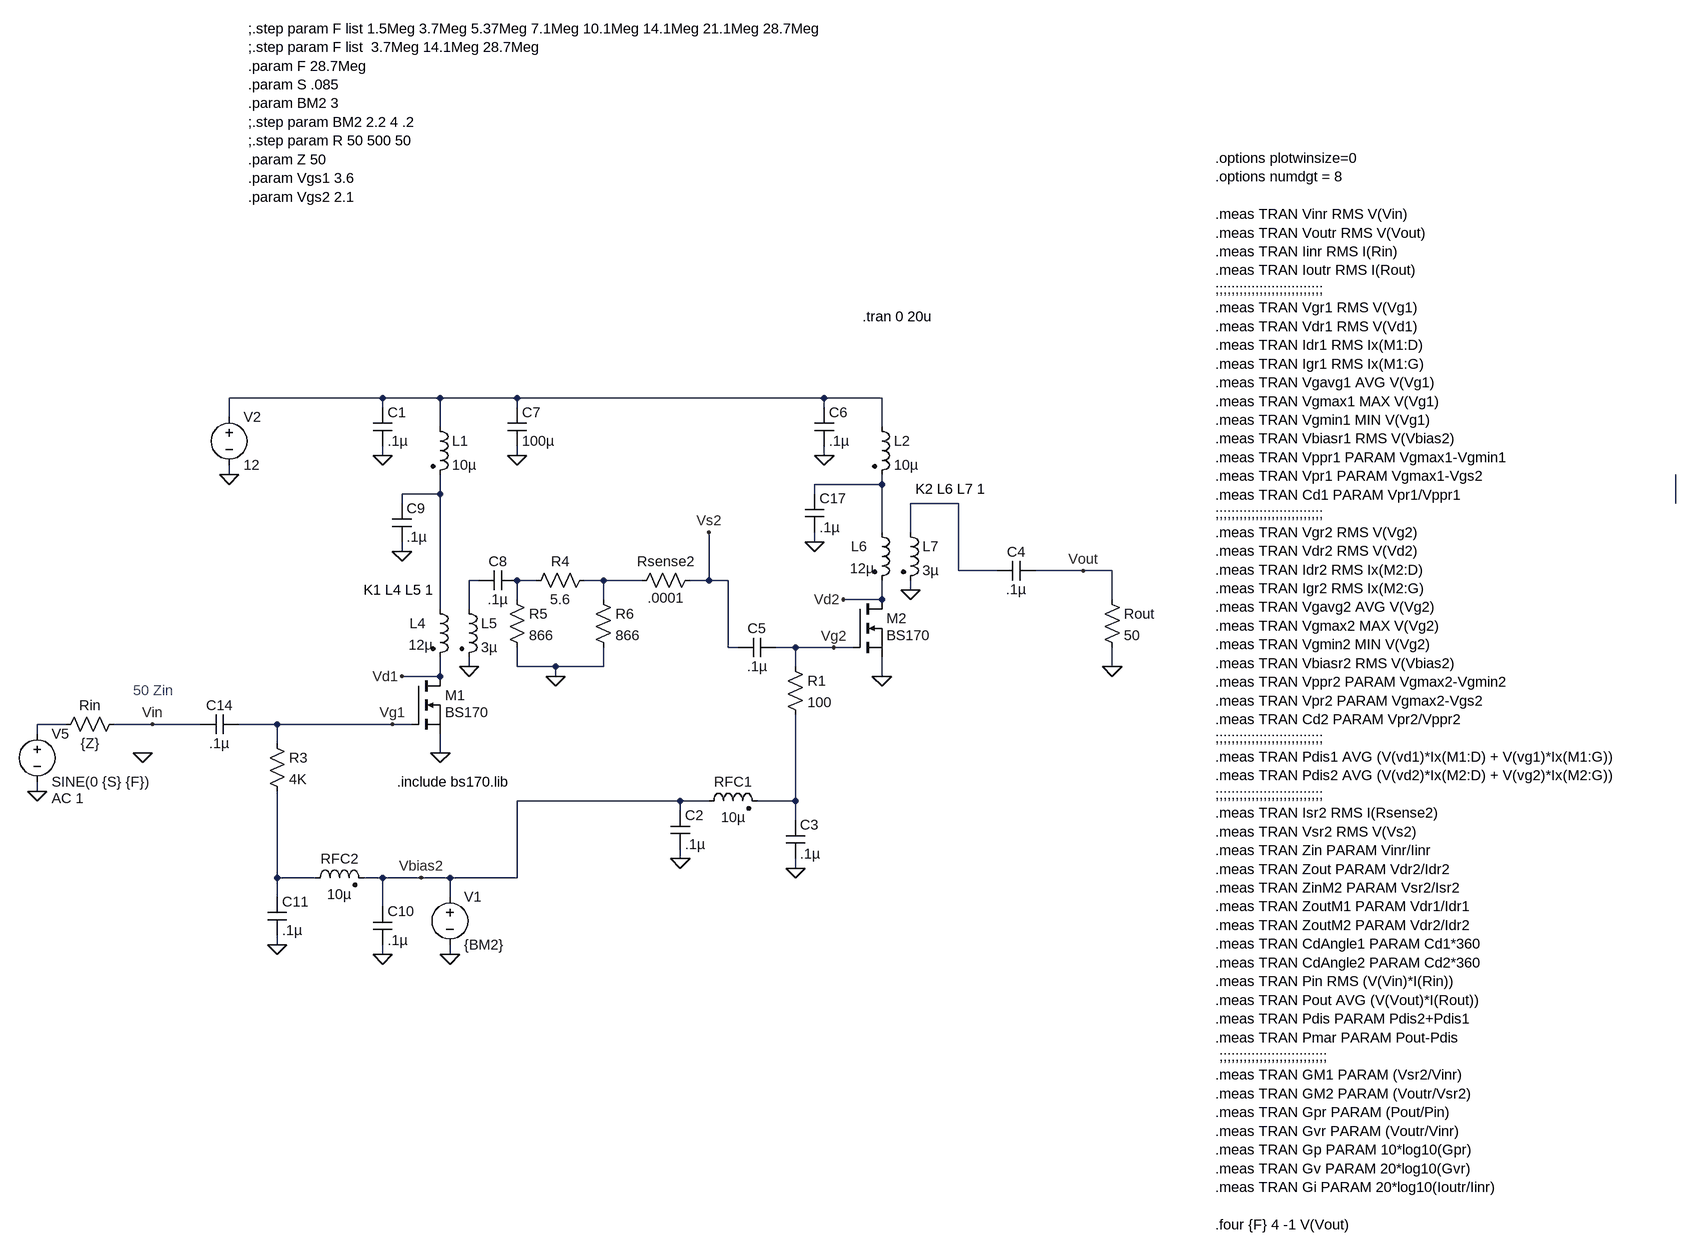
[diagram p0: schematic BS170 x2 Pre Amp Testing.asc]
BS170 x2 Pre Amp Testing.asc, the LTspice schematic file:
Version 4
SHEET 1 4348 1616
WIRE 512 -176 256 -176
WIRE 608 -176 512 -176
WIRE 736 -176 608 -176
WIRE 1248 -176 736 -176
WIRE 1344 -176 1248 -176
WIRE 512 -160 512 -176
WIRE 736 -160 736 -176
WIRE 1248 -160 1248 -176
WIRE 256 -144 256 -176
WIRE 608 -128 608 -176
WIRE 1344 -128 1344 -176
WIRE 512 -80 512 -96
WIRE 736 -80 736 -96
WIRE 1248 -80 1248 -96
WIRE 256 -48 256 -64
WIRE 1344 -32 1344 -48
WIRE 1344 -32 1232 -32
WIRE 608 -16 608 -48
WIRE 608 -16 544 -16
WIRE 1232 -16 1232 -32
WIRE 544 0 544 -16
WIRE 1472 0 1392 0
WIRE 3968 0 3968 -48
WIRE 1344 48 1344 -32
WIRE 1392 48 1392 0
WIRE 1232 64 1232 48
WIRE 544 80 544 64
WIRE 1472 112 1472 0
WIRE 1536 112 1472 112
WIRE 1680 112 1600 112
WIRE 1728 112 1680 112
WIRE 672 128 656 128
WIRE 768 128 736 128
WIRE 880 128 848 128
WIRE 944 128 880 128
WIRE 1056 128 1056 48
WIRE 1056 128 1024 128
WIRE 1088 128 1056 128
WIRE 1392 144 1392 128
WIRE 736 160 736 128
WIRE 880 160 880 128
WIRE 1344 160 1344 128
WIRE 1344 160 1280 160
WIRE 1728 160 1728 112
WIRE 608 176 608 -16
WIRE 656 176 656 128
WIRE 1088 240 1088 128
WIRE 1104 240 1088 240
WIRE 1200 240 1168 240
WIRE 1264 240 1200 240
WIRE 1296 240 1264 240
WIRE 656 272 656 256
WIRE 736 272 736 240
WIRE 800 272 736 272
WIRE 880 272 880 240
WIRE 880 272 800 272
WIRE 1200 272 1200 240
WIRE 1728 272 1728 240
WIRE 608 288 608 256
WIRE 608 288 544 288
WIRE 800 288 800 272
WIRE 1344 288 1344 256
WIRE -16 368 -64 368
WIRE 128 368 64 368
WIRE 208 368 128 368
WIRE 336 368 272 368
WIRE 528 368 336 368
WIRE 560 368 528 368
WIRE -64 384 -64 368
WIRE 336 400 336 368
WIRE 608 416 608 384
WIRE -64 480 -64 464
WIRE 1008 496 736 496
WIRE 1056 496 1008 496
WIRE 1200 496 1200 352
WIRE 1200 496 1136 496
WIRE 1008 512 1008 496
WIRE 1200 528 1200 496
WIRE 1008 592 1008 576
WIRE 1200 608 1200 592
WIRE 336 624 336 480
WIRE 400 624 336 624
WIRE 512 624 480 624
WIRE 576 624 512 624
WIRE 624 624 576 624
WIRE 736 624 736 496
WIRE 736 624 624 624
WIRE 336 656 336 624
WIRE 624 656 624 624
WIRE 512 672 512 624
WIRE 336 736 336 720
WIRE 512 752 512 736
WIRE 624 752 624 736
FLAG 256 -48 0
FLAG 1728 272 0
FLAG 1680 112 Vout
FLAG -64 480 0
FLAG 128 368 Vin
FLAG 608 416 0
FLAG 528 368 Vg1
FLAG 544 288 Vd1
FLAG 512 752 0
FLAG 336 736 0
FLAG 624 752 0
FLAG 576 624 Vbias2
FLAG 112 416 0
FLAG 512 -80 0
FLAG 1344 288 0
FLAG 1264 240 Vg2
FLAG 1280 160 Vd2
FLAG 1008 592 0
FLAG 1200 608 0
FLAG 1248 -80 0
FLAG 736 -80 0
FLAG 1056 48 Vs2
FLAG 544 80 0
FLAG 656 272 0
FLAG 1392 144 0
FLAG 1232 64 0
FLAG 800 288 0
SYMBOL voltage 256 -160 R0
WINDOW 123 0 0 Left 2
WINDOW 39 0 0 Left 2
SYMATTR InstName V2
SYMATTR Value 12
SYMBOL res 1712 144 R0
SYMATTR InstName Rout
SYMATTR Value 50
SYMBOL voltage -64 368 R0
WINDOW 123 24 124 Left 2
WINDOW 39 24 152 Left 2
SYMATTR Value2 AC 1
SYMATTR InstName V5
SYMATTR Value SINE(0 {S} {F})
SYMBOL nmos 560 288 R0
WINDOW 3 56 60 Left 2
SYMATTR Value BS170
SYMATTR InstName M1
SYMATTR Prefix X
SYMBOL res 320 384 R0
SYMATTR InstName R3
SYMATTR Value 4K
SYMBOL cap 1536 128 R270
WINDOW 0 32 32 VTop 2
WINDOW 3 0 32 VBottom 2
SYMATTR InstName C4
SYMATTR Value .1µ
SYMBOL ind2 384 640 R270
WINDOW 0 32 56 VTop 2
WINDOW 3 4 56 VBottom 2
SYMATTR InstName RFC2
SYMATTR Value 10µ
SYMATTR Type ind
SYMBOL cap 496 672 R0
SYMATTR InstName C10
SYMATTR Value .1µ
SYMBOL cap 320 656 R0
SYMATTR InstName C11
SYMATTR Value .1µ
SYMBOL voltage 624 640 R0
WINDOW 123 0 0 Left 2
WINDOW 39 0 0 Left 2
SYMATTR InstName V1
SYMATTR Value {BM2}
SYMBOL ind2 592 -144 R0
SYMATTR InstName L1
SYMATTR Value 10µ
SYMATTR Type ind
SYMBOL cap 208 384 R270
WINDOW 0 32 32 VTop 2
WINDOW 3 0 32 VBottom 2
SYMATTR InstName C14
SYMATTR Value .1µ
SYMBOL cap 496 -160 R0
SYMATTR InstName C1
SYMATTR Value .1µ
SYMBOL nmos 1296 160 R0
WINDOW 3 56 60 Left 2
SYMATTR Value BS170
SYMATTR InstName M2
SYMATTR Prefix X
SYMBOL res 1184 256 R0
SYMATTR InstName R1
SYMATTR Value 100
SYMBOL ind2 1040 512 R270
WINDOW 0 32 56 VTop 2
WINDOW 3 4 56 VBottom 2
SYMATTR InstName RFC1
SYMATTR Value 10µ
SYMATTR Type ind
SYMBOL cap 992 512 R0
SYMATTR InstName C2
SYMATTR Value .1µ
SYMBOL cap 1184 528 R0
SYMATTR InstName C3
SYMATTR Value .1µ
SYMBOL ind2 1328 -144 R0
SYMATTR InstName L2
SYMATTR Value 10µ
SYMATTR Type ind
SYMBOL cap 1104 256 R270
WINDOW 0 32 32 VTop 2
WINDOW 3 0 32 VBottom 2
SYMATTR InstName C5
SYMATTR Value .1µ
SYMBOL cap 1232 -160 R0
SYMATTR InstName C6
SYMATTR Value .1µ
SYMBOL cap 720 -160 R0
SYMATTR InstName C7
SYMATTR Value 100µ
SYMBOL res 1040 112 R90
WINDOW 0 0 56 VBottom 2
WINDOW 3 30 56 VTop 2
SYMATTR InstName Rsense2
SYMATTR Value .0001
SYMBOL res 80 352 R90
WINDOW 0 0 56 VBottom 2
WINDOW 3 32 56 VTop 2
SYMATTR InstName Rin
SYMATTR Value {Z}
SYMBOL ind2 592 160 R0
WINDOW 0 -35 40 Left 2
WINDOW 3 -37 76 Left 2
SYMATTR InstName L4
SYMATTR Value 12µ
SYMATTR Type ind
SYMBOL ind2 640 160 R0
SYMATTR InstName L5
SYMATTR Value 3µ
SYMATTR Type ind
SYMBOL res 864 112 R90
WINDOW 0 0 56 VBottom 2
WINDOW 3 32 56 VTop 2
SYMATTR InstName R4
SYMATTR Value 5.6
SYMBOL res 720 144 R0
SYMATTR InstName R5
SYMATTR Value 866
SYMBOL res 864 144 R0
SYMATTR InstName R6
SYMATTR Value 866
SYMBOL cap 736 112 R90
WINDOW 0 0 32 VBottom 2
WINDOW 3 32 32 VTop 2
SYMATTR InstName C8
SYMATTR Value .1µ
SYMBOL cap 528 0 R0
SYMATTR InstName C9
SYMATTR Value .1µ
SYMBOL ind2 1328 32 R0
WINDOW 0 -35 40 Left 2
WINDOW 3 -37 76 Left 2
SYMATTR InstName L6
SYMATTR Value 12µ
SYMATTR Type ind
SYMBOL ind2 1376 32 R0
SYMATTR InstName L7
SYMATTR Value 3µ
SYMATTR Type ind
SYMBOL cap 1216 -16 R0
SYMATTR InstName C17
SYMATTR Value .1µ
TEXT 2912 -576 Left 2 !.options plotwinsize=0\n.options numdgt = 8\n \n.meas TRAN Vinr RMS V(Vin)\n.meas TRAN Voutr RMS V(Vout)\n.meas TRAN Iinr RMS I(Rin)\n.meas TRAN Ioutr RMS I(Rout)\n;;;;;;;;;;;;;;;;;;;;;;;;;;;\n.meas TRAN Vgr1 RMS V(Vg1)\n.meas TRAN Vdr1 RMS V(Vd1)\n.meas TRAN Idr1 RMS Ix(M1:D)\n.meas TRAN Igr1 RMS Ix(M1:G)\n.meas TRAN Vgavg1 AVG V(Vg1)\n.meas TRAN Vgmax1 MAX V(Vg1)\n.meas TRAN Vgmin1 MIN V(Vg1)\n.meas TRAN Vbiasr1 RMS V(Vbias2)\n.meas TRAN Vppr1 PARAM Vgmax1-Vgmin1\n.meas TRAN Vpr1 PARAM Vgmax1-Vgs2\n.meas TRAN Cd1 PARAM Vpr1/Vppr1\n;;;;;;;;;;;;;;;;;;;;;;;;;;;\n.meas TRAN Vgr2 RMS V(Vg2)\n.meas TRAN Vdr2 RMS V(Vd2)\n.meas TRAN Idr2 RMS Ix(M2:D)\n.meas TRAN Igr2 RMS Ix(M2:G)\n.meas TRAN Vgavg2 AVG V(Vg2)\n.meas TRAN Vgmax2 MAX V(Vg2)\n.meas TRAN Vgmin2 MIN V(Vg2)\n.meas TRAN Vbiasr2 RMS V(Vbias2)\n.meas TRAN Vppr2 PARAM Vgmax2-Vgmin2\n.meas TRAN Vpr2 PARAM Vgmax2-Vgs2\n.meas TRAN Cd2 PARAM Vpr2/Vppr2\n;;;;;;;;;;;;;;;;;;;;;;;;;;;\n.meas TRAN Pdis1 AVG (V(vd1)*Ix(M1:D) + V(vg1)*Ix(M1:G))\n.meas TRAN Pdis2 AVG (V(vd2)*Ix(M2:D) + V(vg2)*Ix(M2:G))\n;;;;;;;;;;;;;;;;;;;;;;;;;;;\n.meas TRAN Isr2 RMS I(Rsense2)\n.meas TRAN Vsr2 RMS V(Vs2)\n.meas TRAN Zin PARAM Vinr/Iinr\n.meas TRAN Zout PARAM Vdr2/Idr2\n.meas TRAN ZinM2 PARAM Vsr2/Isr2\n.meas TRAN ZoutM1 PARAM Vdr1/Idr1\n.meas TRAN ZoutM2 PARAM Vdr2/Idr2\n.meas TRAN CdAngle1 PARAM Cd1*360\n.meas TRAN CdAngle2 PARAM Cd2*360\n.meas TRAN Pin RMS (V(Vin)*I(Rin))\n.meas TRAN Pout AVG (V(Vout)*I(Rout))\n.meas TRAN Pdis PARAM Pdis2+Pdis1\n.meas TRAN Pmar PARAM Pout-Pdis\n ;;;;;;;;;;;;;;;;;;;;;;;;;;;\n.meas TRAN GM1 PARAM (Vsr2/Vinr)\n.meas TRAN GM2 PARAM (Voutr/Vsr2)\n.meas TRAN Gpr PARAM (Pout/Pin)\n.meas TRAN Gvr PARAM (Voutr/Vinr)\n.meas TRAN Gp PARAM 10*log10(Gpr)\n.meas TRAN Gv PARAM 20*log10(Gvr)\n.meas TRAN Gi PARAM 20*log10(Ioutr/Iinr)\n \n.four {F} 4 -1 V(Vout)
TEXT 288 -792 Left 2 !;.step param F list 1.5Meg 3.7Meg 5.37Meg 7.1Meg 10.1Meg 14.1Meg 21.1Meg 28.7Meg\n;.step param F list  3.7Meg 14.1Meg 28.7Meg\n.param F 28.7Meg\n.param S .085\n.param BM2 3\n;.step param BM2 2.2 4 .2\n;.step param R 50 500 50\n.param Z 50\n.param Vgs1 3.6\n.param Vgs2 2.1
TEXT 536 464 Left 2 !.include bs170.lib
TEXT 96 312 Left 2 ;50 Zin
TEXT 1312 -312 Left 2 !.tran 0 20u
TEXT 480 144 Left 2 !K1 L4 L5 1
TEXT 1400 -24 Left 2 !K2 L6 L7 1

The netlist it stands for:
* BS170 x2 Pre Amp Testing.asc
V2 N001 0 12
Rout Vout 0 50
V5 N009 0 SINE(0 {S} {F}) AC 1
XM1 Vd1 Vg1 0 BS170  ; pins D G S
R3 Vg1 N011 4K
C4 N004 Vout .1µ
L§RFC2 N011 Vbias2 10µ
C10 Vbias2 0 .1µ
C11 N011 0 .1µ
V1 Vbias2 0 {BM2}
L1 N001 N003 10µ
C14 Vin Vg1 .1µ
C1 N001 0 .1µ
XM2 Vd2 Vg2 0 BS170  ; pins D G S
R1 Vg2 N010 100
L§RFC1 Vbias2 N010 10µ
C2 Vbias2 0 .1µ
C3 N010 0 .1µ
L2 N001 N002 10µ
C5 Vs2 Vg2 .1µ
C6 N001 0 .1µ
C7 N001 0 100µ
Rsense2 Vs2 N008 .0001
Rin Vin N009 {Z}
L4 N003 Vd1 12µ
L5 N006 0 3µ
R4 N008 N007 5.6
R5 N007 0 866
R6 N008 0 866
C8 N007 N006 .1µ
C9 N003 0 .1µ
L6 N002 Vd2 12µ
L7 N004 0 3µ
C17 N002 0 .1µ
.options plotwinsize=0
.options numdgt = 8
.meas TRAN Vinr RMS V(Vin)
.meas TRAN Voutr RMS V(Vout)
.meas TRAN Iinr RMS I(Rin)
.meas TRAN Ioutr RMS I(Rout)
;;;;;;;;;;;;;;;;;;;;;;;;;;;
.meas TRAN Vgr1 RMS V(Vg1)
.meas TRAN Vdr1 RMS V(Vd1)
.meas TRAN Idr1 RMS Ix(M1:D)
.meas TRAN Igr1 RMS Ix(M1:G)
.meas TRAN Vgavg1 AVG V(Vg1)
.meas TRAN Vgmax1 MAX V(Vg1)
.meas TRAN Vgmin1 MIN V(Vg1)
.meas TRAN Vbiasr1 RMS V(Vbias2)
.meas TRAN Vppr1 PARAM Vgmax1-Vgmin1
.meas TRAN Vpr1 PARAM Vgmax1-Vgs2
.meas TRAN Cd1 PARAM Vpr1/Vppr1
;;;;;;;;;;;;;;;;;;;;;;;;;;;
.meas TRAN Vgr2 RMS V(Vg2)
.meas TRAN Vdr2 RMS V(Vd2)
.meas TRAN Idr2 RMS Ix(M2:D)
.meas TRAN Igr2 RMS Ix(M2:G)
.meas TRAN Vgavg2 AVG V(Vg2)
.meas TRAN Vgmax2 MAX V(Vg2)
.meas TRAN Vgmin2 MIN V(Vg2)
.meas TRAN Vbiasr2 RMS V(Vbias2)
.meas TRAN Vppr2 PARAM Vgmax2-Vgmin2
.meas TRAN Vpr2 PARAM Vgmax2-Vgs2
.meas TRAN Cd2 PARAM Vpr2/Vppr2
;;;;;;;;;;;;;;;;;;;;;;;;;;;
.meas TRAN Pdis1 AVG (V(vd1)*Ix(M1:D) + V(vg1)*Ix(M1:G))
.meas TRAN Pdis2 AVG (V(vd2)*Ix(M2:D) + V(vg2)*Ix(M2:G))
;;;;;;;;;;;;;;;;;;;;;;;;;;;
.meas TRAN Isr2 RMS I(Rsense2)
.meas TRAN Vsr2 RMS V(Vs2)
.meas TRAN Zin PARAM Vinr/Iinr
.meas TRAN Zout PARAM Vdr2/Idr2
.meas TRAN ZinM2 PARAM Vsr2/Isr2
.meas TRAN ZoutM1 PARAM Vdr1/Idr1
.meas TRAN ZoutM2 PARAM Vdr2/Idr2
.meas TRAN CdAngle1 PARAM Cd1*360
.meas TRAN CdAngle2 PARAM Cd2*360
.meas TRAN Pin RMS (V(Vin)*I(Rin))
.meas TRAN Pout AVG (V(Vout)*I(Rout))
.meas TRAN Pdis PARAM Pdis2+Pdis1
.meas TRAN Pmar PARAM Pout-Pdis
 ;;;;;;;;;;;;;;;;;;;;;;;;;;;
.meas TRAN GM1 PARAM (Vsr2/Vinr)
.meas TRAN GM2 PARAM (Voutr/Vsr2)
.meas TRAN Gpr PARAM (Pout/Pin)
.meas TRAN Gvr PARAM (Voutr/Vinr)
.meas TRAN Gp PARAM 10*log10(Gpr)
.meas TRAN Gv PARAM 20*log10(Gvr)
.meas TRAN Gi PARAM 20*log10(Ioutr/Iinr)
.four {F} 4 -1 V(Vout)
;.step param F list 1.5Meg 3.7Meg 5.37Meg 7.1Meg 10.1Meg 14.1Meg 21.1Meg 28.7Meg
;.step param F list  3.7Meg 14.1Meg 28.7Meg
.param F 28.7Meg
.param S .085
.param BM2 3
;.step param BM2 2.2 4 .2
;.step param R 50 500 50
.param Z 50
.param Vgs1 3.6
.param Vgs2 2.1
.include bs170.lib
* 50 Zin
.tran 0 20u
K1 L4 L5 1
K2 L6 L7 1
.backanno
.end